# Altium schematic sheet [04] - 3_inch.SchDoc
size A3; DocumentNumber: 2; SheetNumber: 2; SheetTotal: 4
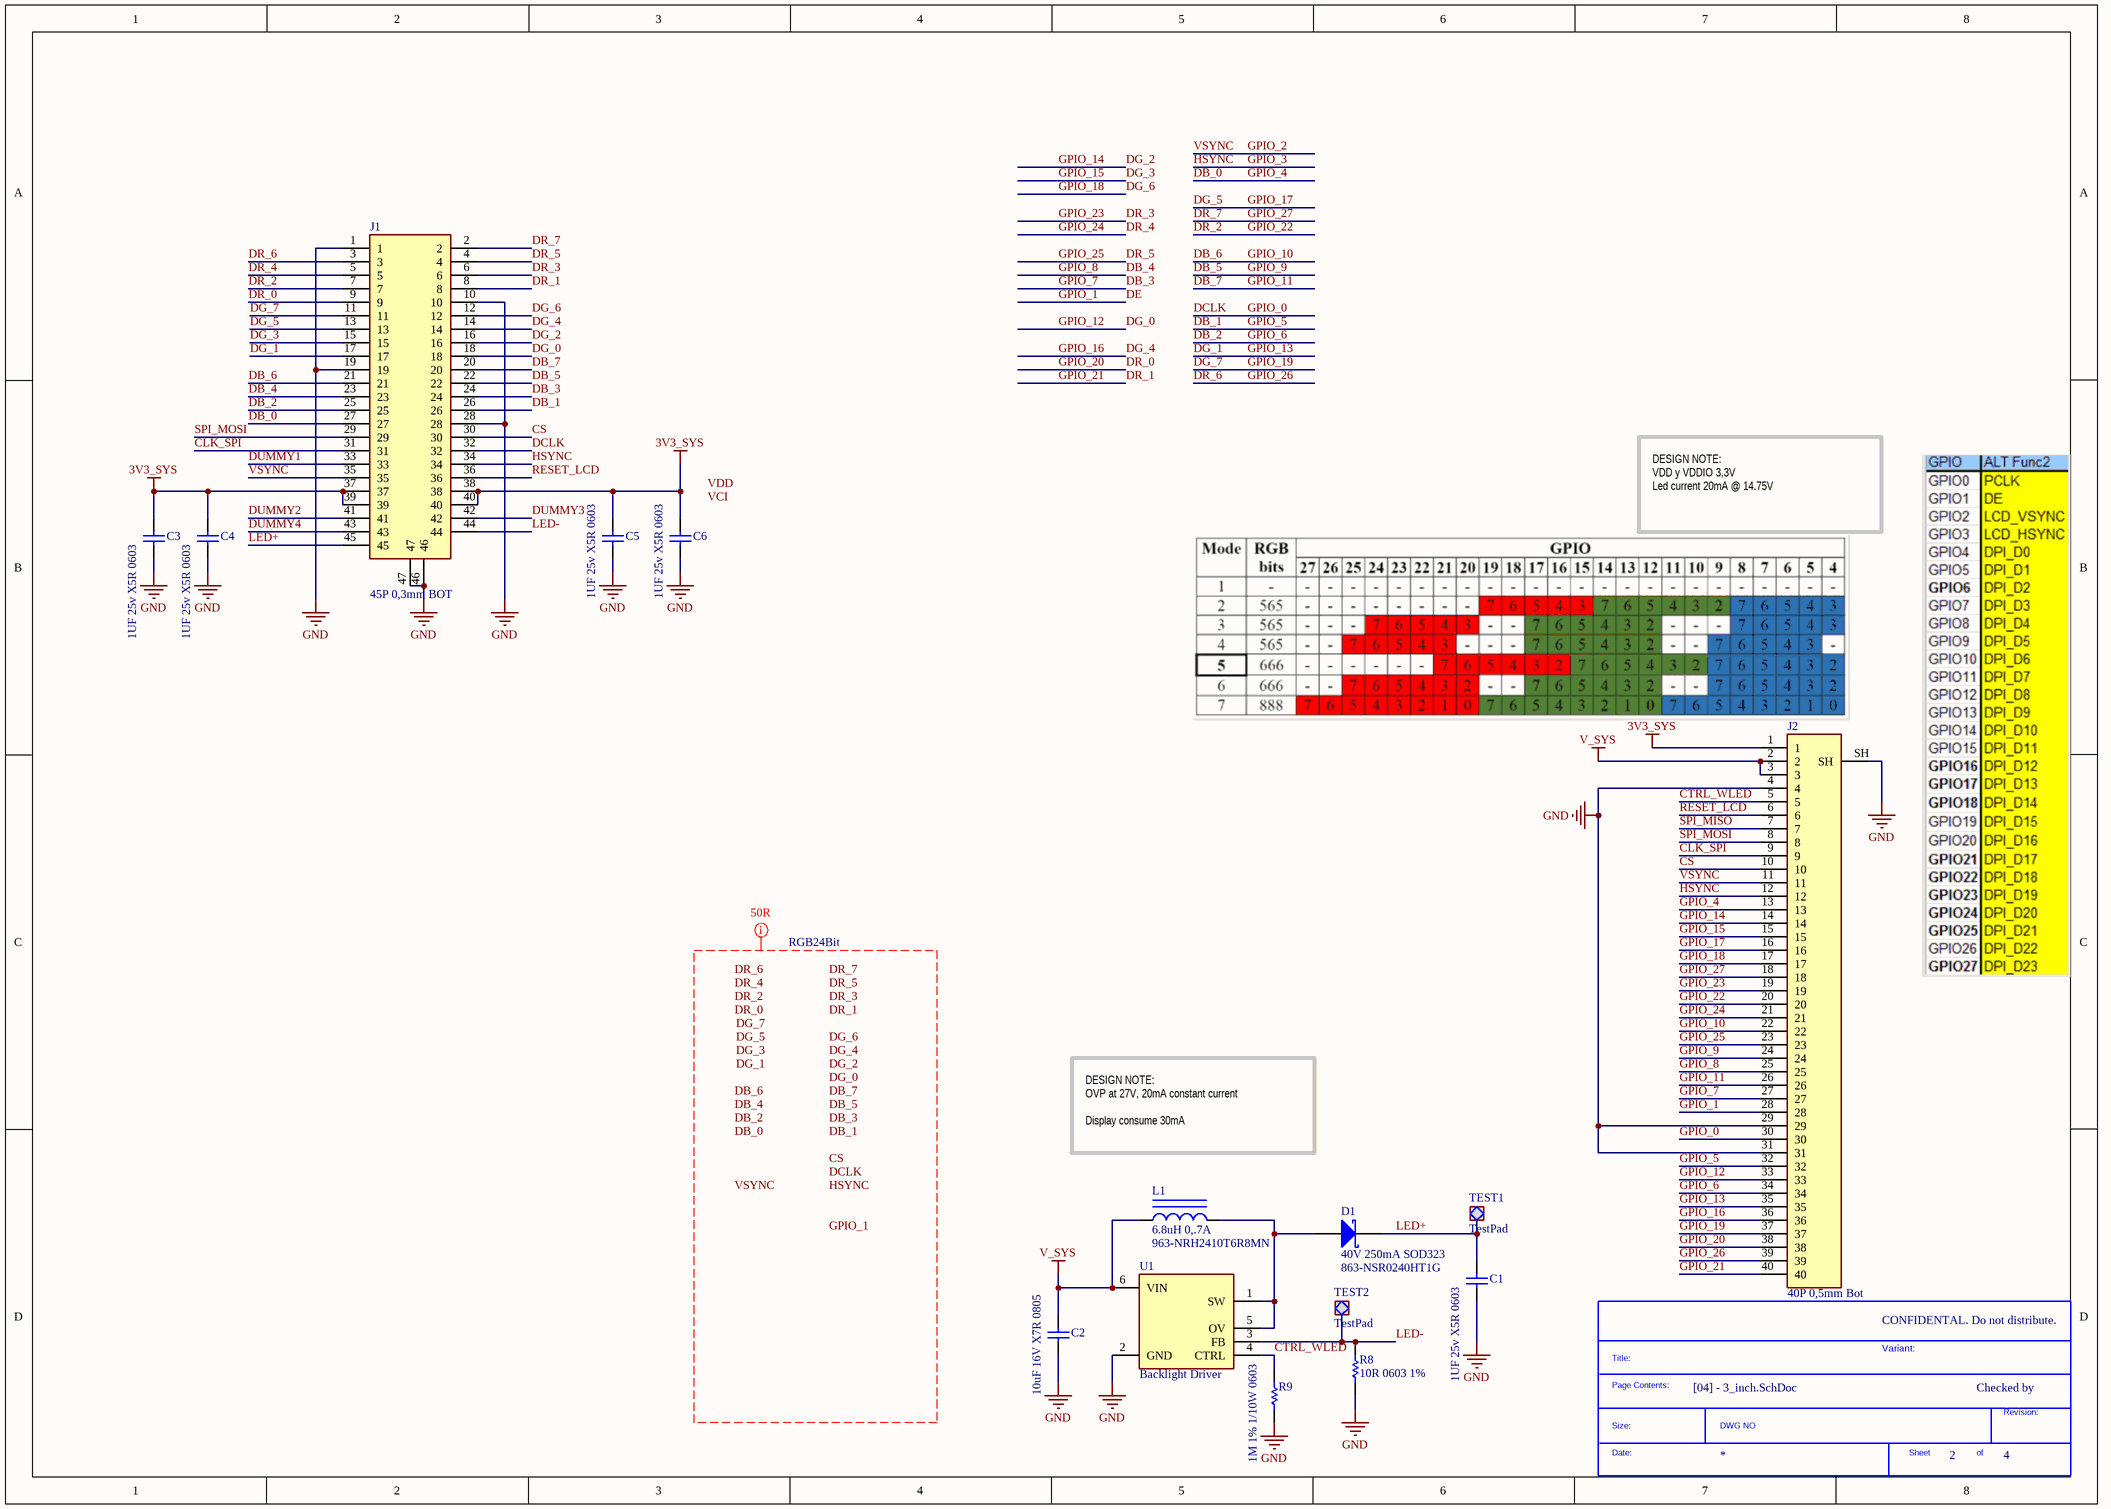
[diagram p0: [04] - 3_inch.SchDoc]

## Parts
*  SDTitleBlock  (value not drawn)  (graphical)
C1  1UF 25v X5R 0603  [C 0603/1608]
C2  10uF 16V X7R 0805  [C 0805/2012]
C3  1UF 25v X5R 0603  [C 0603/1608]
C4  1UF 25v X5R 0603  [C 0603/1608]
C5  1UF 25v X5R 0603  [C 0603/1608]
C6  1UF 25v X5R 0603  [C 0603/1608]
D1  40V 250mA SOD323  Supplier Part Number 1: 863-NSR0240HT1G  [SOD-323]
J1  45P 0,3mm BOT  [FH26W45S03SHW60]
J2  40P 0,5mm Bot  [417345920]
L1  6.8uH 0,.7A  Supplier Part Number 1: 963-NRH2410T6R8MN  [NRH2410T6R8MN]
R8  10R 0603 1%  [R 0603/1608]
R9  1M 1% 1/10W 0603  [R 0603/1608]
TEST1  TestPad  [TestPad]  (no BOM)
TEST2  TestPad  [TestPad]  (no BOM)
U1  Backlight Driver  [SOT95P280X145-6N]

## Nets
3V3_SYS: C3.1 C4.1 C5.1 C6.1 J1.37 J1.38 J1.39 J1.40 J2.1
GND: C1.2 C2.1 C3.2 C4.2 C5.2 C6.2 J1.1 J1.10 J1.19 J1.28 J1.46 J1.47 J2.4 J2.29 J2.31 J2.SH R8.1 R9.1 U1.2(GND)
V_SYS: C2.2 J2.2 J2.3 L1.1 U1.6(VIN)
CLK_SPI: J1.31 J2.9
CS: J1.30 J2.10
CTRL_WLED: J2.5 R9.2 U1.4(CTRL)
DB_0: J1.27 J2.13  [also labelled GPIO_4]
DB_1: J1.26 J2.32  [also labelled GPIO_5]
DB_2: J1.25 J2.34  [also labelled GPIO_6]
DB_3: J1.24 J2.27  [also labelled GPIO_7]
DB_4: J1.23 J2.25  [also labelled GPIO_8]
DB_5: J1.22 J2.24  [also labelled GPIO_9]
DB_6: J1.21 J2.22  [also labelled GPIO_10]
DB_7: J1.20 J2.26  [also labelled GPIO_11]
DCLK: J1.32 J2.30  [also labelled GPIO_0]
DE: J2.28  [also labelled GPIO_1]
DG_0: J1.18 J2.33  [also labelled GPIO_12]
DG_1: J1.17 J2.35  [also labelled GPIO_13]
DG_2: J1.16 J2.14  [also labelled GPIO_14]
DG_3: J1.15 J2.15  [also labelled GPIO_15]
DG_4: J1.14 J2.36  [also labelled GPIO_16]
DG_5: J1.13 J2.16  [also labelled GPIO_17]
DG_6: J1.12 J2.17  [also labelled GPIO_18]
DG_7: J1.11 J2.37  [also labelled GPIO_19]
DR_0: J1.9 J2.38  [also labelled GPIO_20]
DR_1: J1.8 J2.40  [also labelled GPIO_21]
DR_2: J1.7 J2.20  [also labelled GPIO_22]
DR_3: J1.6 J2.19  [also labelled GPIO_23]
DR_4: J1.5 J2.21  [also labelled GPIO_24]
DR_5: J1.4 J2.23  [also labelled GPIO_25]
DR_6: J1.3 J2.39  [also labelled GPIO_26]
DR_7: J1.2 J2.18  [also labelled GPIO_27]
DUMMY1: J1.33
DUMMY2: J1.41
DUMMY3: J1.42
DUMMY4: J1.43
GPIO_2: J1.35 J2.11  [also labelled VSYNC]
GPIO_3: J1.34 J2.12  [also labelled HSYNC]
LED+: C1.1 D1.1(K) J1.45 TEST1.1
LED-: J1.44 R8.2 TEST2.1 U1.3(FB)
RESET_LCD: J1.36 J2.6
SPI_MISO: J2.7
SPI_MOSI: J1.29 J2.8
NetD1_2: D1.2(A) L1.2 U1.1(SW) U1.5(OV)

## Layout directives
net class RGB24Bit; rule Width Constraint [Pref Width = 0.18mm    Min Width = 0.18mm    Max Width = 0.18mm]: CS, DB_0, DB_1, DB_2, DB_3, DB_4, DB_5, DB_6, DB_7, DCLK, DG_0, DG_1, DG_2, DG_3, DG_4, DG_5, DG_6, DG_7, DR_0, DR_1, DR_2, DR_3, DR_4, DR_5, DR_6, DR_7, GPIO_1, HSYNC, VSYNC

## Notes on the sheet
- DESIGN NOTE:
  VDD y VDDIO 3,3V
  Led current 20mA @ 14.75V
- DESIGN NOTE:
  OVP at 27V, 20mA constant current
  Display consume 30mA
- CONFIDENTAL. Do not distribute.
- Variant:
- Checked by
- Labels drawn without touching a wire or pin: CS, DB_0, DB_1, DB_2, DB_3, DB_4, DB_5, DB_6, DB_7, DCLK, DG_0, DG_1, DG_2, DG_3, DG_4, DG_5, DG_6, DG_7, DR_0, DR_1, DR_2, DR_3, DR_4, DR_5, DR_6, DR_7, GPIO_1, HSYNC, VCI, VDD, VSYNC
- (in symbol SDTitleBlock) Title:; Page Contents:; Revision:; Size:; DWG NO; Date:; Sheet; of

## Library data of the parts
C1 C3-C6 = CC0603KRX5R8BB105: CAP CER 1UF 25V X5R 0603; Manufacturer: Yageo; Tolerance: 10%; Supplier 1: Mouser; Manufacturer Part Number: CC0603KRX5R8BB105; RoHS: Yes; Stock 1: 9567246; Pricing 1: 1 = 0,10000, 10 = 0,04700, 50 = 0,04700, 100 = 0,01700, 1000 = 0,01600, 10000 = 0,00800 (USD); Mount: Surface Mount; Case/Package: 0603; Number of Pins: 2; Case Code (Metric): 1608; Case Code (Imperial): 0603; Min Operating Temperature: -55°C; Max Operating Temperature: 85°C; Package Quantity: 1; Capacitance: 1uF; Voltage Rating: 25V; Packaging: Tape and Reel; Dielectric: X5R; Termination: SMD/SMT; Voltage Rating (DC): 25V; Length: 1.6mm; Height: 0.8mm; Width: 0.031inch; Thickness: 0.035inch; Depth: 0.8mm; Radiation Hardening: No; REACH SVHC: No SVHC; Lead Free: Lead Free; Halogen Free: Halogen Free; ComponentLink1URL: https://datasheet.ciiva.com/176/mlccorderingcode-176785.pdf?src-supplier=Digi-Key; ComponentLink1Description: https://datasheet.ciiva.com/176/mlccorderingcode-176785.pdf?src-supplier=Digi-Key; ComponentLink2URL: https://datasheet.ciiva.com/176/mlccorderingcode-176786.pdf?src-supplier=Digi-Key; ComponentLink2Description: https://datasheet.ciiva.com/176/mlccorderingcode-176786.pdf?src-supplier=Digi-Key; ComponentLink3URL: https://datasheet.ciiva.com/176/mlccorderingcode-176787.pdf?src-supplier=Digi-Key; ComponentLink3Description: https://datasheet.ciiva.com/176/mlccorderingcode-176787.pdf?src-supplier=Digi-Key; ComponentLink4URL: https://datasheet.ciiva.com/17436/upy-gphc-x5r-4v-to-50v-12-17436952.pdf?src-supplier=Avnet+Europe; ComponentLink4Description: https://datasheet.ciiva.com/17436/upy-gphc-x5r-4v-to-50v-12-17436952.pdf?src-supplier=Avnet+Europe; ComponentLink5URL: https://datasheet.ciiva.com/7978/1525783-7978171.pdf?src-supplier=Element14; ComponentLink5Description: https://datasheet.ciiva.com/7978/1525783-7978171.pdf?src-supplier=Element14; ComponentLink6URL: https://datasheet.ciiva.com/11586/upy-gphc-x5r-4v-to-50v-12-11586318.pdf?src-supplier=Avnet; ComponentLink6Description: https://datasheet.ciiva.com/11586/upy-gphc-x5r-4v-to-50v-12-11586318.pdf?src-supplier=Avnet; Supplier Part Number 1: 603-CC603KRX5R8BB105
C2 = CL21B106KOQNNNE: CAP CER 10UF 16V X7R 0805; Manufacturer: Samsung Electro-Mechanics; Tolerance: ±10%; Notification: Current market demand for these product types have resulted in fluctuating and extending lead times. Lead times may differ.; Supplier 1: Digi-Key; Manufacturer Part Number: CL21B106KOQNNNE; RoHS: RoHS Compliant; Category: Capacitors; Stock 1: 20000; Pricing 1: 1=0.24, 10=0.163, 100=0.0923, 500=0.06514, 1000=0.057 (GBP); Packaging: Cut Tape (CT); Part Status: Active; Voltage - Rated: 16V; Temperature Coefficient: X7R; Operating Temperature: -55°C ~ 125°C; Features: -; Ratings: -; Applications: General Purpose; Mounting Type: Surface Mount, MLCC; Package / Case: 0805 (2012 Metric); Size / Dimension: 0.079" L x 0.049" W (2.00mm x 1.25mm); Height - Seated (Max): -; Thickness (Max): 0.055" (1.40mm); Lead Spacing: -; Lead Style: -; ComponentLink1URL: http://www.samsungsem.com/kr/support/product-search/mlcc/CL21B106KOQNNNE.jsp; ComponentLink1Description: http://www.samsungsem.com/kr/support/product-search/mlcc/CL21B106KOQNNNE.jsp; Supplier Part Number 1: 1276-2872-1-ND
D1 = NSR0240HT1G: DIODE SCHOTTKY 40V 250MA SOD323; Manufacturer: ON Semiconductor; Max Surge Current: 1A; Recovery Time: 3ns; Peak Reverse Current: 10uA; Forward Voltage: 710mV; Power Dissipation: 270mW; Element Configuration: Single; Supplier 1: Mouser; Manufacturer Part Number: NSR0240HT1G; RoHS: Yes; Stock 1: 30582; Pricing 1: 1 = 0,23000, 10 = 0,15400, 50 = 0,15400, 100 = 0,06500, 1000 = 0,04400, 10000 = 0,03000 (USD); Case/Package: SOD-323-2; Number of Pins: 2; Contact Plating: Tin; Min Operating Temperature: -55°C; Max Operating Temperature: 150°C; Package Quantity: 1; Forward Current: 250mA; Packaging: Tape and Reel; Max Reverse Leakage Current: 10uA; Average Rectified Current: 250mA; Reverse Recovery Time: 3ns; Max Repetitive Reverse Voltage (Vrrm): 40V; Peak Non-Repetitive Surge Current: 1A; Max Forward Surge Current (Ifsm): 1A; Max Reverse Voltage (DC): 40V; Length: 1.8mm; Height: 1mm; Width: 1.35mm; Radiation Hardening: No; REACH SVHC: No SVHC; Lead Free: Lead Free; ComponentLink1URL: https://datasheet.ciiva.com/4714/nsr0240h-d-113658-4714368.pdf?src-supplier=Mouser; ComponentLink1Description: https://datasheet.ciiva.com/4714/nsr0240h-d-113658-4714368.pdf?src-supplier=Mouser; ComponentLink2URL: https://datasheet.ciiva.com/8293/nsr0240h-d-8293840.pdf?src-supplier=Avnet; ComponentLink2Description: https://datasheet.ciiva.com/8293/nsr0240h-d-8293840.pdf?src-supplier=Avnet; ComponentLink3URL: https://datasheet.ciiva.com/25949/nsr0240h-d-25949637.pdf?src-supplier=Avnet+Europe; ComponentLink3Description: https://datasheet.ciiva.com/25949/nsr0240h-d-25949637.pdf?src-supplier=Avnet+Europe; ComponentLink4URL: https://datasheet.ciiva.com/915/nsr0240h-d-915416.pdf?src-supplier=Digi-Key; ComponentLink4Description: https://datasheet.ciiva.com/915/nsr0240h-d-915416.pdf?src-supplier=Digi-Key; ComponentLink5URL: https://datasheet.ciiva.com/915/nsr0240h-d-915417.pdf?src-supplier=Digi-Key; ComponentLink5Description: https://datasheet.ciiva.com/915/nsr0240h-d-915417.pdf?src-supplier=Digi-Key; ComponentLink6URL: https://datasheet.ciiva.com/16396/nsr0240h-d-16396521.pdf?src-supplier=Future+Electronics; ComponentLink6Description: https://datasheet.ciiva.com/16396/nsr0240h-d-16396521.pdf?src-supplier=Future+Electronics; ComponentLink7URL: https://datasheet.ciiva.com/915/nsr0240h-d-915418.pdf?src-supplier=Digi-Key; ComponentLink7Description: https://datasheet.ciiva.com/915/nsr0240h-d-915418.pdf?src-supplier=Digi-Key; ComponentLink8URL: https://datasheet.ciiva.com/7963/nsr0240h-d-7963165.pdf?src-supplier=Element14; ComponentLink8Description: https://datasheet.ciiva.com/7963/nsr0240h-d-7963165.pdf?src-supplier=Element14
J1 = FH26W-45S-0.3SHW(60): FFC FPC Connectors Horizontal Mounting Angle Light Brown 0.3 mm - Pitch 45 Positions; Manufacturer: Hirose; Supplier 1: Mouser; Manufacturer Part Number: FH26W-45S-0.3SHW(60); RoHS: Yes; Category: FFC / FPC; Stock 1: 44650; Pricing 1: 1=2,29000, 10=1,92000, 50=1,92000, 100=1,79000, 1000=1,28000, 10000=1,13000 (USD); ComponentLink1URL: http://www.farnell.com/datasheets/2691081.pdf?src-supplier=Farnell; ComponentLink1Description: http://www.farnell.com/datasheets/2691081.pdf?src-supplier=Farnell; ComponentLink2URL: https://www.hirose.com/product/document?clcode=CL0580-2401-1-60&amp;productname=FH26W-13S-0.3SHW(60)&amp;series=FH26&amp;documenttype=Catalog&amp;lang=en&amp;documentid=D49355_en&src-supplier=Digi-Key; ComponentLink2Description: https://www.hirose.com/product/document?clcode=CL0580-2401-1-60&amp;productname=FH26W-13S-0.3SHW(60)&amp;series=FH26&amp;documenttype=Catalog&amp;lang=en&amp;documentid=D49355_en&src-supplier=Digi-Key; ComponentLink3URL: https://www.hirose.com/product/en/download_file/key_name/FH26W-61S-0.3SHW%2860%29/category/Drawing%20(2D)/doc_file_id/43329/?file_category_id=6&item_id=05802418460&is_series=&src-supplier=Digi-Key; ComponentLink3Description: https://www.hirose.com/product/en/download_file/key_name/FH26W-61S-0.3SHW%2860%29/category/Drawing%20(2D)/doc_file_id/43329/?file_category_id=6&item_id=05802418460&is_series=&src-supplier=Digi-Key; ComponentLink4URL: https://www.hirose.com/product/en/download_file/key_name/FH26/category/Catalog/doc_file_id/49355/?file_category_id=4&item_id=298&is_series=1&src-supplier=Digi-Key; ComponentLink4Description: https://www.hirose.com/product/en/download_file/key_name/FH26/category/Catalog/doc_file_id/49355/?file_category_id=4&item_id=298&is_series=1&src-supplier=Digi-Key; Supplier Part Number 1: 798-FH26W45S03SHW60
J2 = 4-1734592-0: CONN FPC BOTTOM 40POS 0.50MM R/A; Manufacturer: TE Connectivity; Actuator Material: Thermoplastic; Actuator Color: Beige; Number of Contacts: 40; Current Rating: 500mA; Voltage Rating: 250V; Gender: Female; Shielding: Unshielded; Connector Type: Receptacle,Connector,Socket; Wire/Cable Type: Flat Flex; Connector System: Flex-to-Board; Mating Alignment: Yes (With); PCB Mount Alignment: No (Without); PCB Mount Retention: With; PCB Mounting Orientation: Right Angle; Contact Resistance: 35mR; Pitch: 0.5mm; Plating Thickness: 0.025um; Supplier 1: Mouser; Manufacturer Part Number: 4-1734592-0; RoHS: Yes; Category: FFC / FPC; Stock 1: 14667; Pricing 1: 1=0,99000, 10=0,82200, 50=0,82200, 100=0,78800, 1000=0,75400, 10000=0,66800 (USD); Mount: Surface Mount; Contact Plating: Gold; Contact Material: Bronze; Housing Color: Natural; Housing Material: Polymer; Min Operating Temperature: -40°C; Max Operating Temperature: 85°C; Number of Rows: 1; Termination: SMD/SMT; Orientation: Right Angle; Packaging: Tape and Reel; Package Quantity: 2000; Number of Positions: 40; Contact Location: Bottom; Sealable: No (Without); Shrouded: Yes (With); Contact Current Rating: 500mA; Series: -; Max Voltage Rating (AC): 250V; Length: 25.43mm; Width: 5.1mm; Height: 2.05mm; Depth: 5.1mm; Radiation Hardening: No; ELV: Compliant; Flammability Rating: UL94 V-0; RoHS Compliant: Yes; Lead Free: Lead Free; Reach SVHC Compliant: Yes; ComponentLink1URL: https://datasheet.ciiva.com/16317/4-1734592-0-16317310.pdf?src-supplier=Future+Electronics; ComponentLink1Description: https://datasheet.ciiva.com/16317/4-1734592-0-16317310.pdf?src-supplier=Future+Electronics; ComponentLink2URL: https://datasheet.ciiva.com/10365/eng-ds-1-1773440-6-0506-10365927.pdf?src-supplier=Avnet; ComponentLink2Description: https://datasheet.ciiva.com/10365/eng-ds-1-1773440-6-0506-10365927.pdf?src-supplier=Avnet; ComponentLink3URL: https://datasheet.ciiva.com/46396/1795029-46396773.pdf?src-supplier=Element14; ComponentLink3Description: https://datasheet.ciiva.com/46396/1795029-46396773.pdf?src-supplier=Element14; ComponentLink4URL: https://datasheet.ciiva.com/1437/586796-1437950.pdf?src-supplier=Element14; ComponentLink4Description: https://datasheet.ciiva.com/1437/586796-1437950.pdf?src-supplier=Element14; ComponentLink5URL: https://datasheet.ciiva.com/669/eng-cd-1734592-c-c-1734592-669272.pdf?src-supplier=Digi-Key; ComponentLink5Description: https://datasheet.ciiva.com/669/eng-cd-1734592-c-c-1734592-669272.pdf?src-supplier=Digi-Key; ComponentLink6URL: https://datasheet.ciiva.com/669/eng-cd-1734592-c-c-1734592-669273.pdf?src-supplier=Digi-Key; ComponentLink6Description: https://datasheet.ciiva.com/669/eng-cd-1734592-c-c-1734592-669273.pdf?src-supplier=Digi-Key; ComponentLink7URL: https://datasheet.ciiva.com/669/eng-cd-1734592-c-c-1734592-669274.pdf?src-supplier=Digi-Key; ComponentLink7Description: https://datasheet.ciiva.com/669/eng-cd-1734592-c-c-1734592-669274.pdf?src-supplier=Digi-Key; Supplier Part Number 1: 571-4-1734592-0
L1 = NRH2410T6R8MN: Inductor Power Shielded Wirewound 6.8uH 20% 100KHz Ferrite 0.57A 0.492Ohm DCR T/R; Manufacturer: Taiyo Yuden; Current Rating: 570mA; Saturation Current: 750mA; Self Resonant Frequency: 43MHz; DC Resistance (DCR): 492mR; Supplier 1: Mouser; Manufacturer Part Number: NRH2410T6R8MN; RoHS: Yes; Category: Fixed Inductors; Stock 1: 34335; Pricing 1: 1=0,23000, 10=0,15400, 50=0,15400, 100=0,12400, 1000=0,09100, 10000=0,06800 (USD); Mount: Surface Mount; Case/Package: Nonstandard; Number of Pins: 2; Core Material: Ferrite; Min Operating Temperature: -25°C; Max Operating Temperature: 120°C; Tolerance: 20%; Shielding: Shielded; Packaging: Tape and Reel; Inductance: 6.8uH; Resistor Type: Wirewound; Test Frequency: 100kHz; Package Quantity: 2500; Inductance Tolerance: 20%; Max DC Current: 750mA; Termination: SMD/SMT; Series: NRH; Length: 2.4mm; Width: 0.094inch; Height: 1mm; Height - Seated (Max): 0.039inch; Lead Pitch: 1.45mm; Depth: 2.5mm; Radiation Hardening: No; RoHS Compliant: Yes; REACH SVHC: No SVHC; Halogen Free: Halogen Free; ComponentLink1URL: https://datasheet.ciiva.com/1043/nrh2410t6r8mn-ss-1043809.pdf?src-supplier=Digi-Key; ComponentLink1Description: https://datasheet.ciiva.com/1043/nrh2410t6r8mn-ss-1043809.pdf?src-supplier=Digi-Key; ComponentLink2URL: https://datasheet.ciiva.com/8502/nrh2410t6r8mn-ss-8502817.pdf?src-supplier=Avnet; ComponentLink2Description: https://datasheet.ciiva.com/8502/nrh2410t6r8mn-ss-8502817.pdf?src-supplier=Avnet; ComponentLink3URL: https://datasheet.ciiva.com/25606/0900766b810b3cd2-25606903.pdf?src-supplier=RSComponents; ComponentLink3Description: https://datasheet.ciiva.com/25606/0900766b810b3cd2-25606903.pdf?src-supplier=RSComponents
R8 = RT0603FRE0710RL: High Precision-High Stability Chip Resistor Thin Film 0603 10Ohm 1% Paper T/R; Manufacturer: Yageo; Power Rating: 100mW; Voltage Rating: 75V; Temperature Coefficient: 50ppm/°C; Supplier 1: Mouser; Manufacturer Part Number: RT0603FRE0710RL; RoHS: Yes; Category: Chip SMD Resistors; Stock 1: 38412; Pricing 1: 1=0,10000, 10=0,06200, 50=0,06200, 100=0,02500, 1000=0,01200, 10000=0,00800 (USD); Case/Package: 0603; Number of Pins: 2; Case Code (Metric): 1608; Case Code (Imperial): 0603; Contact Plating: Tin,Lead; Min Operating Temperature: -55°C; Max Operating Temperature: 125°C; Tolerance: 1%; Resistance: 10R; Packaging: Tape and Reel; Package Quantity: 5000; Resistor Type: Thin Film; Number of Terminations: 2; Termination: SMD/SMT; Max Power Dissipation: 100mW; Voltage Rating (DC): 75V; Features: Moisture Resistant; Series: RT; Construction: Rectangular; Resistance Tolerance: 1%; Length: 1.6mm; Width: 0.031inch; Height: 0.022inch; Depth: 0.8mm; REACH SVHC: Unknown; Military Standard: Not; Lead Free: Lead Free; RoHS Compliant: Yes; ComponentLink1URL: https://datasheet.ciiva.com/12834/pyu-rt-1-to-0-05-rohs-l-4-12834894.pdf?src-supplier=Mouser; ComponentLink1Description: https://datasheet.ciiva.com/12834/pyu-rt-1-to-0-05-rohs-l-4-12834894.pdf?src-supplier=Mouser; ComponentLink2URL: https://datasheet.ciiva.com/2559/pyu-rt-1-to-0-05-rohs-l-5-2559486.pdf?src-supplier=Digi-Key; ComponentLink2Description: https://datasheet.ciiva.com/2559/pyu-rt-1-to-0-05-rohs-l-5-2559486.pdf?src-supplier=Digi-Key; Supplier Part Number 1: 603-RT0603FRE0710RL
R9 = RC0603FR-071ML: RES SMD 1M OHM 1% 1/10W 0603; Manufacturer 1: Yageo; Voltage Rating: 50V; Resistance: 1MR; Power Rating: 100mW; Temperature Coefficient: 100ppm/°C; Supplier 1: Digi-Key; Manufacturer Part Number 1: RC0603FR-071ML; Stock 1: 9751331; Pricing 1: 1=0,10000, 10=0,02400, 100=0,00970, 1000=0,00437, 2500=0,00379 (USD); RoHS: Yes; Case/Package: 0603; Number of Pins: 2; Case Code (Imperial): 0603; Case Code (Metric): 1608; Min Operating Temperature: -55°C; Max Operating Temperature: 155°C; Voltage Rating (DC): 50V; Tolerance: 1%; Packaging: Tape and Reel; Package Quantity: 5000; Termination: SMD/SMT; Composition: Thick Film; Military Standard: Not; Length: 1.6mm; Height: 0.45mm; Width: 0.8mm; Depth: 0.8mm; REACH SVHC: No SVHC; Lead Free: Lead Free; ComponentLink1URL: https://datasheet.ciiva.com/11819/0900766b80f96399-11819295.pdf?src-supplier=RSComponents; ComponentLink1Description: https://datasheet.ciiva.com/11819/0900766b80f96399-11819295.pdf?src-supplier=RSComponents; ComponentLink2URL: https://datasheet.ciiva.com/7983/443971-7983614.pdf?src-supplier=Element14; ComponentLink2Description: https://datasheet.ciiva.com/7983/443971-7983614.pdf?src-supplier=Element14; ComponentLink3URL: https://datasheet.ciiva.com/12555/rc0603-272842-12555388.pdf?src-supplier=Mouser; ComponentLink3Description: https://datasheet.ciiva.com/12555/rc0603-272842-12555388.pdf?src-supplier=Mouser; Supplier Part Number 1: 311-1.00MHRDKR-ND
TEST1 TEST2 = PP_SMT_ROUND_2MM: Probe Pad, SMT, ROUND, 2.0MM
U1 = AP3032KTR-G1: AP3032 Series 9 V 1.3 MHz Surface Mount White LED Step-Up Converter - SOT-23-6; Manufacturer: Diodes; Number of Outputs: 1; Frequency: 1MHz; Max Supply Voltage: 9V; Output Current per Channel: 1.4A; Min Input Voltage: 2.7V; Max Output Voltage: 38V; Switching Frequency: 750kHz; Topology: Boost; Dimming: PWM; Supplier 1: Mouser; Manufacturer Part Number: AP3032KTR-G1; RoHS: Yes; Category: LED Drivers; Stock 1: 35875; Pricing 1: 1=0,41000, 10=0,33600, 50=0,33600, 100=0,20700, 500=0,17200, 1000=0,12900, 3000=0,11700, 9000=0,10300, 10000=0,10300, 24000=0,09700 (USD); Mount: Surface Mount; Case/Package: SOT-23-6; Number of Pins: 6; Weight: 0.000529oz; Min Operating Temperature: -40°C; Max Operating Temperature: 85°C; Package Quantity: 3000; Packaging: Tape and Reel; Max Input Voltage: 9V; Number of Channels: 1; Lead Free: Lead Free; RoHS Compliant: Yes; ComponentLink1URL: https://datasheet.ciiva.com/29602/ap3032-29602682.pdf?src-supplier=Digi-Key; ComponentLink1Description: https://datasheet.ciiva.com/29602/ap3032-29602682.pdf?src-supplier=Digi-Key; ComponentLink2URL: https://datasheet.ciiva.com/29603/ap3032-29603101.pdf?src-supplier=Digi-Key; ComponentLink2Description: https://datasheet.ciiva.com/29603/ap3032-29603101.pdf?src-supplier=Digi-Key; ComponentLink3URL: https://datasheet.ciiva.com/29603/ap3032-29603100.pdf?src-supplier=Digi-Key; ComponentLink3Description: https://datasheet.ciiva.com/29603/ap3032-29603100.pdf?src-supplier=Digi-Key; Supplier Part Number 1: 621-AP3032KTR-G1